# Altium schematic sheet Nixie Valve Clock Rotary Encoder Daughterboard.SchDoc
size A4; SheetNumber: 1; SheetTotal: 1
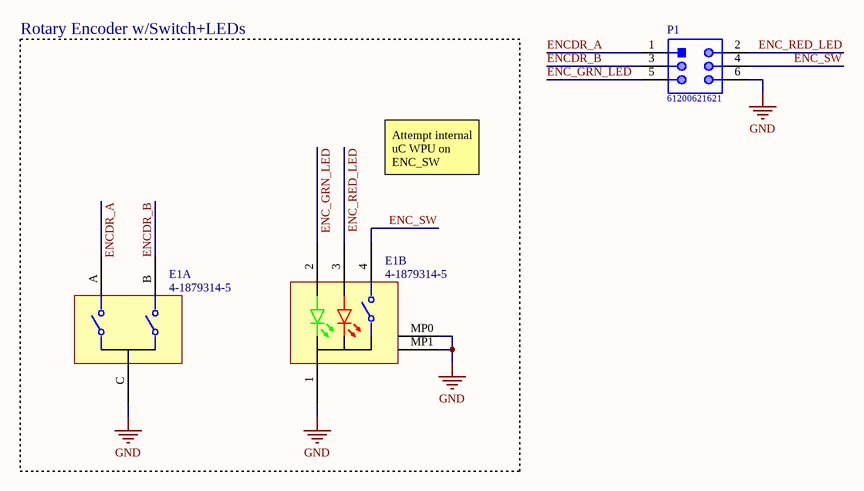
[diagram p0: Nixie Valve Clock Rotary Encoder Daughterboard.SchDoc]

## Parts
?  (no value)
E1  4-1879314-5  [4-1879314-5-Footprint-1]  (parts A,B of 2)
P1  61200621621  [61200621621]

## Blocks framed on the sheet
Rotary Encoder w/Switch+LEDs: E1

## Nets
GND: E1.1 E1.C E1.MP0(Mounting_Point_0) E1.MP1(Mounting_Point_1) P1.6
ENC_GRN_LED: E1.2(Green_LED) P1.5
ENC_RED_LED: E1.3(Red_LED) P1.2
ENC_SW: E1.4(Switch) P1.4
ENCDR_A: E1.A P1.1
ENCDR_B: E1.B P1.3

## Notes on the sheet
- Attempt internal uC WPU on ENC_SW
- Project:
- Designer:
- Sheet
- of
- Filename:

## Library data of the parts
? = CMP-00003-4: The KETS Schematic Sheet Title Block
E1 = CMP-010-00025-2: Incremental Encoder, Mechanical, 24Ppr Rohs Compliant: Yes; Max Supply Voltage: 5V; Number of Channels: 2; Pulses per Revolution: 24; Value: 25kΩ; Hole Diameter: 1.1mm; RoHS: Compliant; Color: Green, Red; Lifecycle Status: Production; Pins: 7; Max Operating Temperature: 85°C; Min Operating Temperature: -40°C; Built in Switch: Yes; Mounting Technology: Surface Mount; Termination: Through Hole; China RoHS: Compliant; ELV: Compliant; REACH SVHC: Yes; RoHS Compliant: Yes
P1 = CMP-002-00109-1: Board Connector, 6 Contact(s), 2 Row(s), Male, Straight, Solder Terminal; Option: General Purpose; Number of Rows Loaded: 2; MIL Conformance: No; Number of Contacts: 6; Connector Type: BOARD CONNECTOR; Reach SVHC Compliant: Yes; JESD-609 Code: e4; Flammability Rating: UL94 V-0; Terminal Pitch: 2.54mm; DIN Conformance: No; Contact Gender: Male; Mounting Technology: Board; Termination: Solder; Mounting Style: STRAIGHT; Filter Feature: No; Contact Finish - Mating: GOLD; RoHS Compliant: Yes; Contact Finish - Termination: Gold (Au) - with Nickel (Ni) barrier; Mixed Contacts: No; Contact Material: Copper Alloy; IEC Conformance: No